# EasyEDA Pro project QV-601-Contril.eprj

# Schematic Schematic1
Board Name: Schematic2; Create Date: 2025-07-12; Page Name: P1; Project Name: QV-601-Contril; Schematic Name: Schematic1; Update Date: 2025-07-23; Company: 嘉立创EDA; Page Size: A4; Version: V1.0
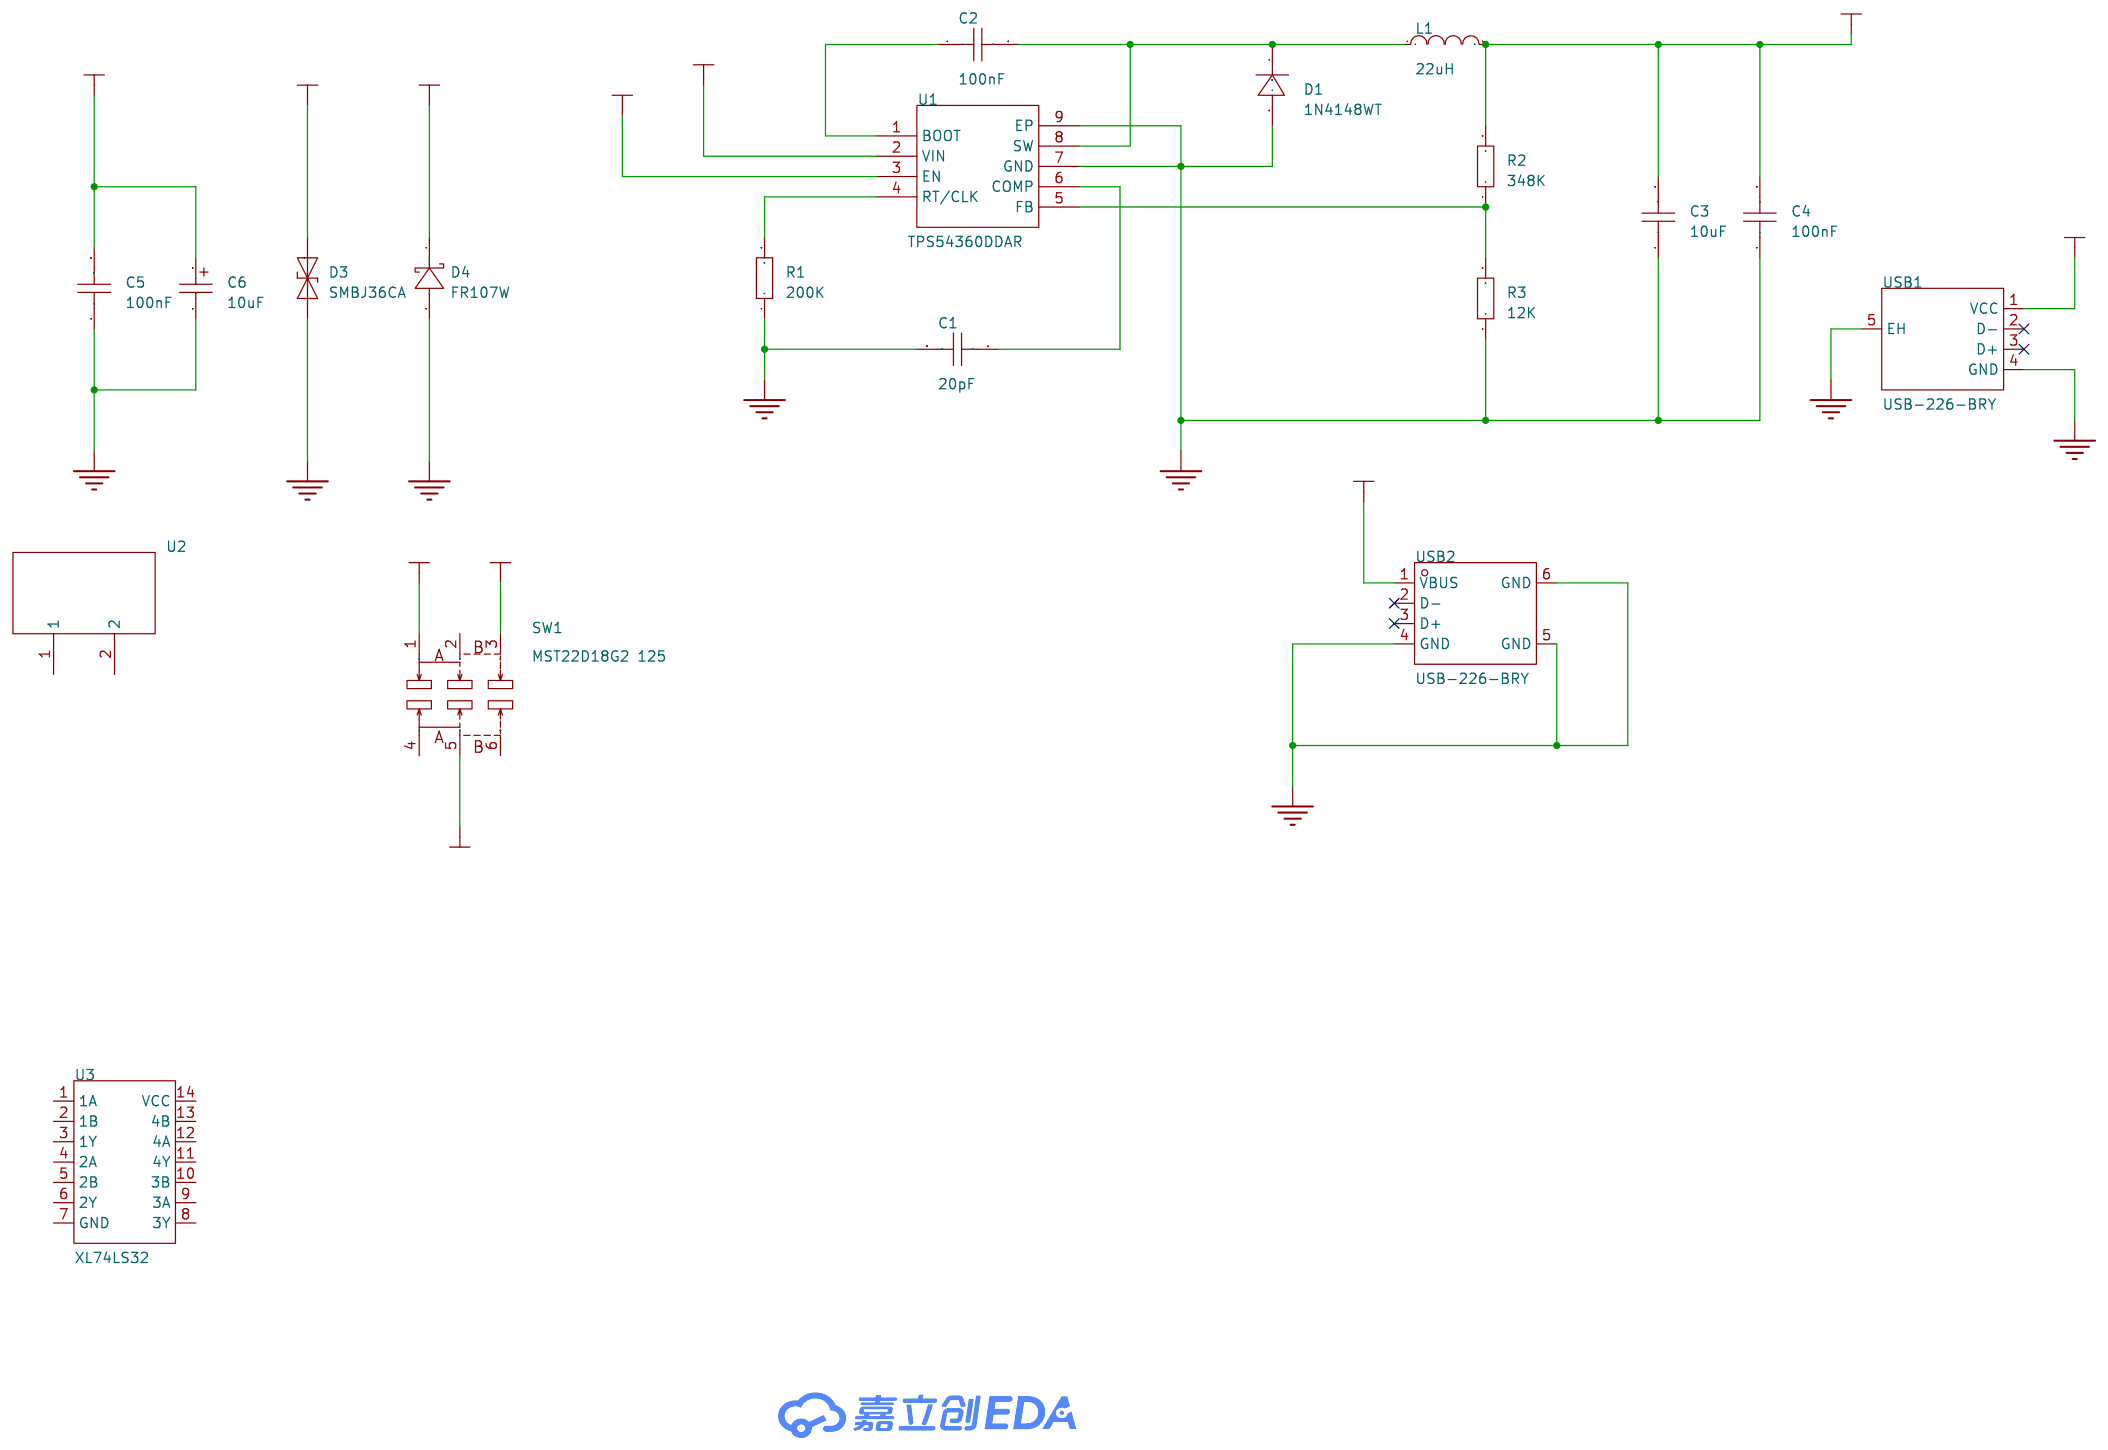
[diagram p0: schematic sheet]

## Parts
C1  20pF  [C0603]
C2  100nF  [C0603]
C3  10uF  [C0603]
C4  100nF  [C0603]
C5  100nF  [C0603]
C6  10uF  [C_Ele_SMD_3x5.4mm]
D1  1N4148WT  [SOD-523_L1.2-W0.8-LS1.6-RD]
D3  SMBJ36CA  [SMB_L4.6-W3.6-LS5.3-BI]
D4  FR107W  [SOD-123FL_L2.7-W1.8-LS3.8-RD]
L1  22uH  [L0603]
R1  200K  [R0603]
R2  348K  [R0603]
R3  12K  [R0603]
SW1  MST22D18G2 125  [SW-SMD_MST22D18G2]
U1  TPS54360DDAR  [SOIC-8_L5.0-W4.0-P1.27-LS6.0-BL-EP2.0]
U2  -  [QS8-S]
U3  XL74LS32  [SOP-14_L8.6-W3.9-P1.27-LS6.0-BL]
USB1  USB-226-BRY  [USB-A-TH_USB-226-BRY]
USB2  USB-226-BRY  [USB-A_TH_USB-256-BRWH150]

## Library data of the parts
C1-C5 = CAP_0603: Supplier Footprint: 0603
C6 = C_Ele_SMD_3x5.4mm: Supplier Footprint: SMD,3x5.4mm
D1 = 1N4148WT_C232841: LCSC Part Name: 电压:75V 电流:300mA; Supplier Part: C232841; Manufacturer: onsemi(安森美); Supplier Footprint: SOD-523F; JLCPCB Part Class: 扩展库; Datasheet: https://atta.szlcsc.com/upload/public/pdf/source/20181222/C232841_42C5BA49E5A441BB8F6B91D0F4CD0D51.pdf; Supplier: LCSC; Diode Configuration: 独立式; Forward Voltage (Vf@If): 1V@10mA; Reverse Voltage (Vr): 75V; Rectified Current: 300mA; Reverse Leakage Current: 5uA@75V; Reverse Recovery Time (trr): 4ns; Operating Temperature: -55℃~+150℃@(Tj)
D3 = SMBJ36CA_C83326: Supplier Part: C83326; Manufacturer: Littelfuse(美国力特); Supplier Footprint: SMB(DO-214AA); JLCPCB Part Class: 扩展库; Datasheet: https://atta.szlcsc.com/upload/public/pdf/source/20190807/C409416_D98C874D944FBE9BE31A2BD6B7A21533.pdf; Supplier: LCSC; polarity: 双向; Reverse Stand-Off Voltage (Vrwm): 36V; Maximum Clamping Voltage: 58.1V; Peak Pulse Current (Ipp): 10.4A; Peak Pulse Power Dissipation (Ppp): 600W; Breakdown Voltage: 40V; Type: TVS
D4 = FR107W_C18199114: Supplier Part: C18199114; Manufacturer: 宏嘉诚; Supplier Footprint: SOD-123FL; JLCPCB Part Class: 扩展库; Datasheet: https://atta.szlcsc.com/upload/public/pdf/source/20250116/CFD3D02D7202F2D6A6FEE7AEEDFF5E78.pdf; Supplier: LCSC; Diode Configuration: 独立式; Voltage - Forward(Vf@If): 1.3V@1.0A; Voltage - DC Reverse(Vr): 1kV; Current - Rectified: 1A; Reverse Leakage Current (Ir): 2uA@1000V; Reverse Recovery Time (trr): 500ns; Operating Temperature: -55℃~+150℃
L1 = L_0603
R1-R3 = Res_0603: Supplier Footprint: 0603
SW1 = MST22D18G2 125: LCSC Part Name: 拨动开关/两档立式 6脚贴片 柄长2.0mm 大六立贴 9.1*3.5mm; Supplier Part: C2906280; Manufacturer: SHOU HAN(首韩); Supplier Footprint: SMD; JLCPCB Part Class: 扩展库; Datasheet: https://atta.szlcsc.com/upload/public/pdf/source/20211019/449AD4EDF23AADA7A5C4E3C063EDBB30.pdf; Supplier: LCSC; Circuit: 双刀双掷; Pin Style: 鸥翼型; Mounting Style: 立贴; Actuator Color: 黑色; Current Rating (DC): 100mA; Voltage Rating (DC): 12V; Mechanical Life: 1万次; Operating Temperature: -25℃~+70℃
U1 = TPS54360DDAR: LCSC Part Name: 60V输入、3.5A输出降压DC-DC转换器; Supplier Part: C44377; Manufacturer: TI(德州仪器); Supplier Footprint: SOIC-8-EP; JLCPCB Part Class: 扩展库; Datasheet: https://www.ti.com/cn/lit/gpn/tps54360; Supplier: LCSC; Function: 降压型; Output Type: 可调; Input Voltage: 4.5V~60V; Output Voltage: 800mV~58.8V; Output Current: 3.5A; Switching Frequency: 2.5MHz; Operating Temperature: -40℃~+150℃@(TJ); Synchronous Rectification: 否; Number of Outputs: 1; Topology: 降压式; Switch tube (built-in/external): 内置
U2 = QS8-S
U3 = XL74LS32: Supplier Part: C521171; Manufacturer: XINLUDA(信路达); Supplier Footprint: SOP-14; JLCPCB Part Class: 扩展库; Datasheet: https://atta.szlcsc.com/upload/public/pdf/source/20250314/78143E60B3C3BA26B82B813CC99E43A0.pdf; Supplier: LCSC
USB1 = USB-226-BRY: LCSC Part Name: Type-A 母 侧插; Supplier Part: C720523; Manufacturer: XUNPU(讯普); Supplier Footprint: 插件; JLCPCB Part Class: 扩展库; Datasheet: https://atta.szlcsc.com/upload/public/pdf/source/20250304/9D0DDAB7BEF0F27DF71E5AD865AFBDD8.pdf; Supplier: LCSC; Connector Type: Type-A; Protocol Standard: USB 2.0; Gender: 母; Mounting Type: 侧插; Number of Contacts: 4P; Number of Ports: 1; Current Rating-Power: 1.5A; Operating Temperature: -20℃~+70℃
USB2 = USB-256-BRWH150: LCSC Part Name: Type-A 母 直插; Supplier Part: C720544; Manufacturer: XUNPU(讯普); Supplier Footprint: 插件; JLCPCB Part Class: 扩展库; Datasheet: https://atta.szlcsc.com/upload/public/pdf/source/20200812/C720544_3A01B35EF472B7FB04986893C594DBBE.pdf; Supplier: LCSC; Connector Type: Type-A; Standard: USB 2.0; Gender: 母; Number of Ports: 1; Number of Contacts: 4P; Mounting Style: 直插; Current Rating - Power (Max): 1.5A; Operating Temperature Range: -20℃~+70℃; Soldering Temperature(Max): 260℃

## Nets
GND: C1.2 C3.1 C4.1 C5.1 C6.2 D1.2(A) D3.1(K) D4.2(A) R1.1 R3.1 U1.7(GND) U1.9(EP) USB1.4(GND) USB1.5(EH) USB2.4(GND) USB2.5(GND) USB2.6(GND)
VCC_5V: U1.3(EN) USB1.1(VCC) USB2.1(VBUS)
VCC_24V: C3.2 C4.2 D3.2(A) D4.1(K) L1.2 R2.2 SW1.1 SW1.5
V+: C5.2 C6.1 SW1.3 U1.2(VIN)
Net-(C1-1): C1.1 U1.6(COMP)
Net-(C2-1): C2.1 U1.1(BOOT)
Net-(C2-2): C2.2 D1.1(C) L1.1 U1.8(SW)
Net-(R1-2): R1.2 U1.4(RT/CLK)
Net-(R2-1): R2.1 R3.2 U1.5(FB)

Not connected (* = marked no-connect by the designer): SW1 2 4 6; U2 1 2; U3 1(1A) 2(1B) 3(1Y) 4(2A) 5(2B) 6(2Y) 7(GND) 8(3Y) 9(3A) 10(3B) 11(4Y) 12(4A) 13(4B) 14(VCC); USB1 2(D-)* 3(D+)*; USB2 2(D-)* 3(D+)*

# Board QV-601-Contril
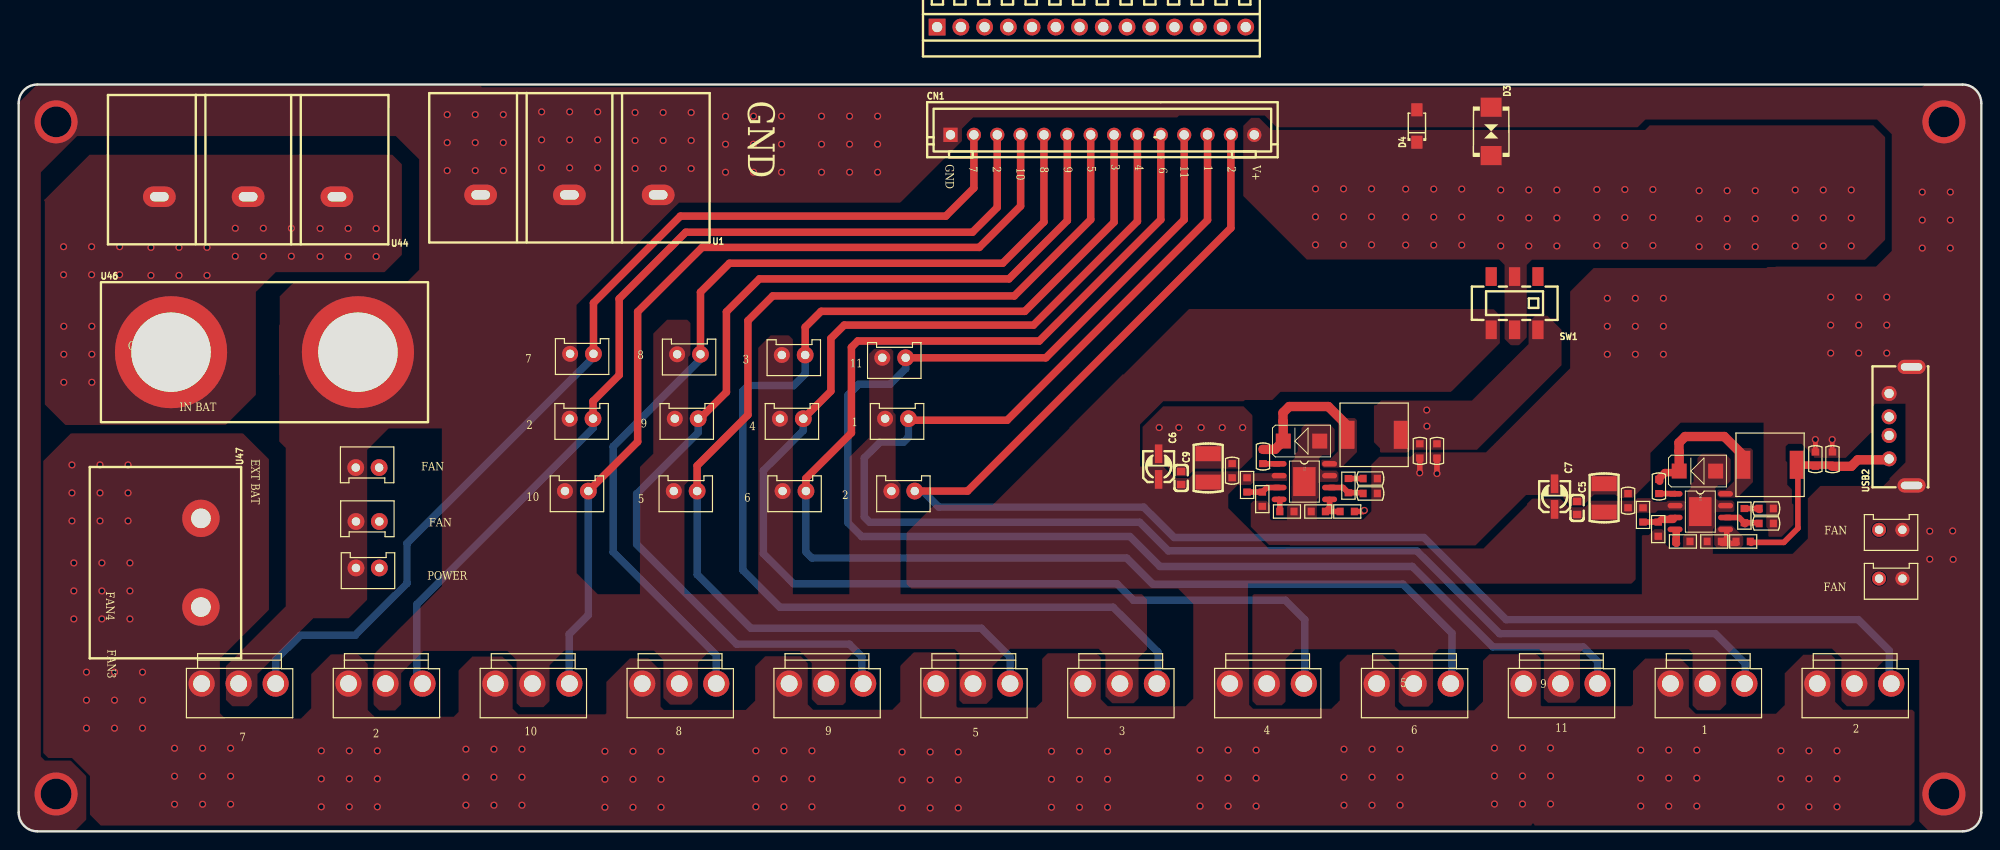
[diagram p1: board, top side]
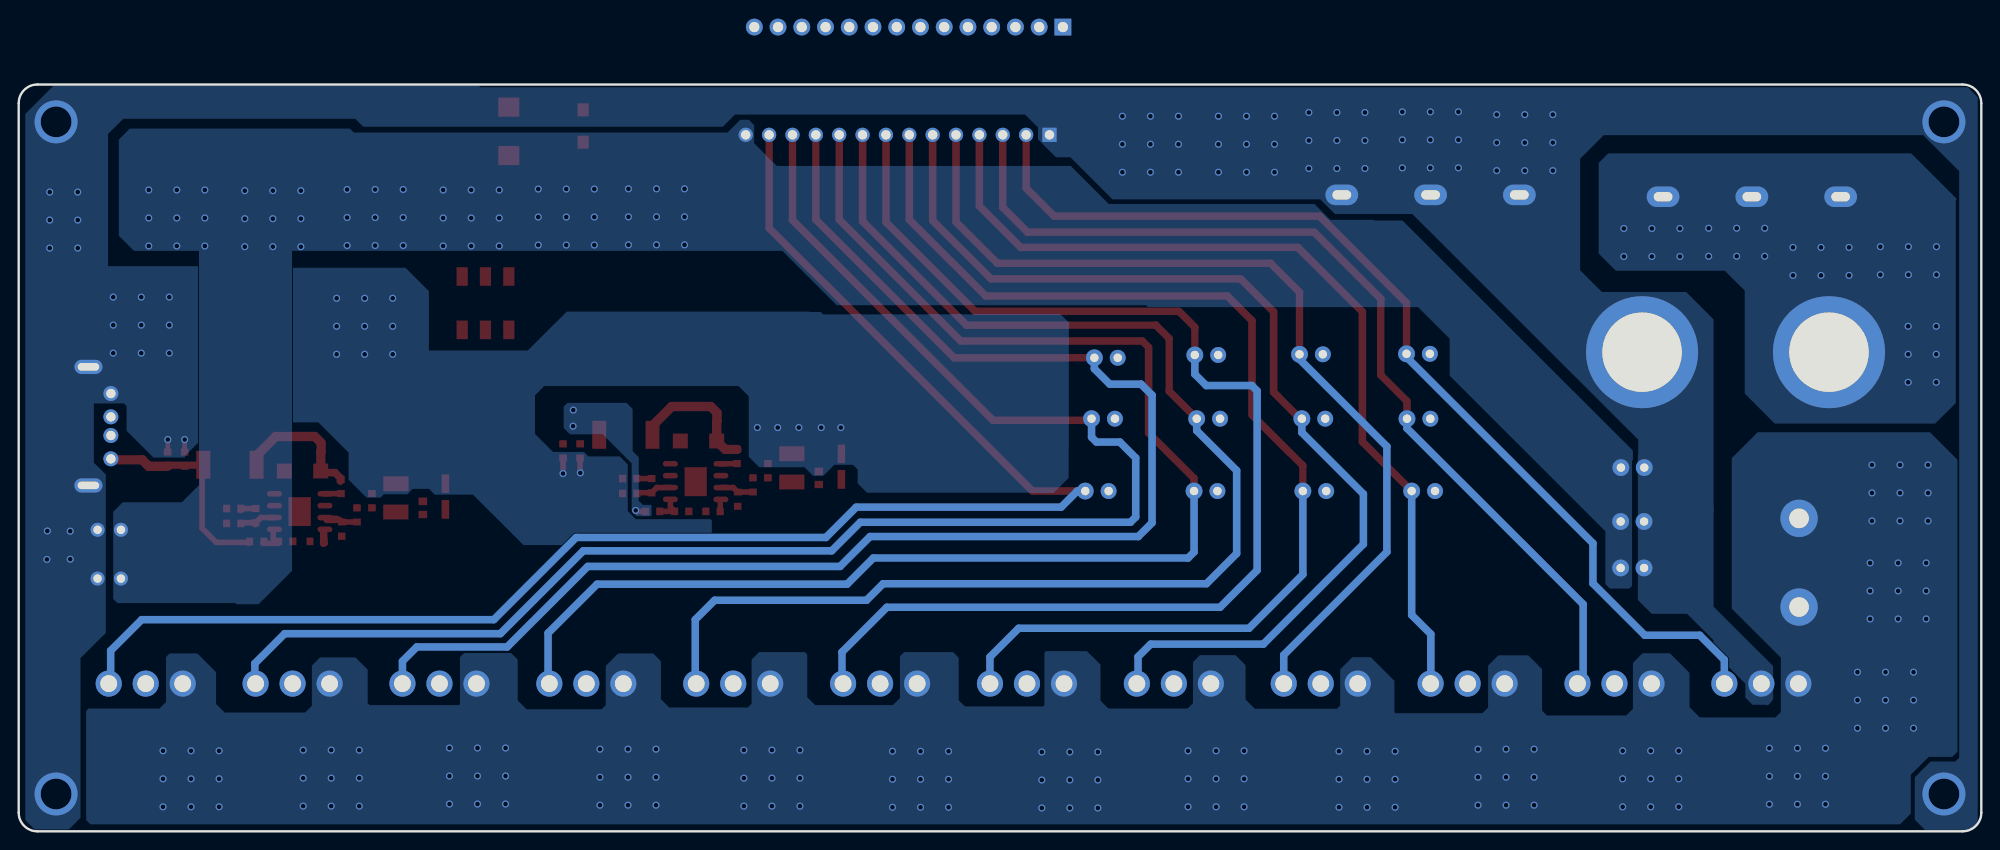
[diagram p2: board, bottom side, seen from below]

Outline 210 x 80 mm; copper layers: Top Layer, Bottom Layer. Coordinates in mm from the lower left corner of the outline.
Outline path: 0,78 0,2 arc(0.59,0.59) 2,0 208,0 arc(209.41,0.59) 210,2 210,78 arc(209.41,79.41) 208,80 2,80 arc(0.59,79.41) 0,78
Stack: Top Layer 0.035mm / Dielectric1 1.51mm FR4 er 4.5 / Bottom Layer 0.035mm

## Design rules (mm)
net J1: Top Side Components
net L4: Top Side Components
net R40: Top Side Components
net R38: Top Side Components
net R37: Top Side Components
net R39: Top Side Components
net R36: Top Side Components
net R35: Top Side Components
net D1: Top Side Components
net C56: Top Side Components
net C52: Top Side Components
net C57: Top Side Components
net C54: Top Side Components
net C53: Top Side Components
net C59: Top Side Components
net C58: Top Side Components
net U41: Top Side Components
net U40: Top Side Components
net J9: Top Side Components
net J8: Top Side Components
net J7: Top Side Components
net J6: Top Side Components
net J5: Top Side Components
net J4: Top Side Components
net J3: Top Side Components
net J15: Top Side Components
net J14: Top Side Components
net J13: Top Side Components
net J12: Top Side Components
net J11: Top Side Components
net J10: Top Side Components
net U9: Top Side Components
net U8: Top Side Components
net U7: Top Side Components
net U6: Top Side Components
net U5: Top Side Components
net U12: Top Side Components
net U11: Top Side Components
net U10: Top Side Components
net U2: Top Side Components
net U3: Top Side Components
net U1: Top Side Components
net J2: Top Side Components
net U4: Top Side Components
template: 用户自定义配置
spacing Clearance (default): track to track 0.254, other pairs 0 to 0.254
track width Width (default): min 0.5, default 1, max 2
differential pair DiffPairsRouting (default): width min 0.381, default 0.381, max 0.381; gap min 0.254, default 0.254
via RoutingVias (default): diameter min 0.61, default 0.762, max 4.6; hole min 0.305, default 0.508, max 3.3

## Placement (name value [footprint] x y rotation side)
C1  20pF  [C0603#2]  149.93 40.75 270 top
C2  100nF  [C0603#2]  151.76 40.75 270 top
C3  10uF  [C1210]  127.27 38.93 90 top
C4  100nF  [C0603#2]  129.84 38.63 90 top
C5  100nF  [C0603]  166.75 34.64 270 top
C6  10uF  [C_Ele_SMD_3x5.4mm]  121.98 39.07 270 top
C7  10uF  [C_Ele_SMD_3x5.4mm]  164.35 35.86 270 top
C8  CAP NP_C0603_100NF  [C0603#2]  133.14 40.15 90 top
C9  100nF  [C0603]  124.38 37.85 270 top
C10  CAP NP_C0603_100NF  [C0603#2]  144.62 37.79 180 top
C11  CAP NP_C0603_100NF  [C0603#2]  144.62 36.19 180 top
C52  CAP NP_C0603_100NF  [C0603#2]  175.51 36.94 90 top
C53  CAP NP_C0603_10UF/10V  [C0603#2]  194.07 39.86 90 top
C54  CAP NP_C0603_10UF/10V  [C0603#2]  192.24 39.86 90 top
C56  CAP NP_C1210_10UF/50V  [C1210]  169.64 35.72 90 top
C57  CAP NP_C0603_100NF  [C0603#2]  172.2 35.42 90 top
C58  CAP NP_C0603_100NF  [C0603#2]  186.99 32.98 180 top
C59  CAP NP_C0603_100NF  [C0603#2]  186.99 34.58 180 top
CN1  ZX-XH2.54-14PZZ  [CONN-TH_14P-P2.50_ZX-XH2.54-14PZZ]  115.96 74.61 0 top
D1  1N4148WT  [SMA]  179.63 38.59 180 top
D2  SS54_SMA_SS34  [SMA]  137.26 41.81 180 top
D3  SMBJ36CA  [SMB_L4.6-W3.6-LS5.3-BI]  157.56 74.98 270 top
D4  FR107W  [SOD-123FL_L2.7-W1.8-LS3.8-RD]  149.61 75.55 90 top
J1  CON2_XH2R54-21_ZX-XH2.54-2PZZ  [XH2R54-21#2]  70.09 36.45 0 top
J2  CON2_XH2R54-21_ZX-XH2.54-2PZZ  [XH2R54-21#2]  92.7 44.2 0 top
J3  CON2_XH2R54-21_ZX-XH2.54-2PZZ  [XH2R54-21]  38.56 38.96 180 top
J4  CON2_XH2R54-21_ZX-XH2.54-2PZZ  [XH2R54-21#3]  199.06 27.08 0 top
J5  CON2_XH2R54-21_ZX-XH2.54-2PZZ  [XH2R54-21#3]  199.06 32.3 0 top
J6  CON2_XH2R54-21_ZX-XH2.54-2PZZ  [XH2R54-21#2]  59 51.15 0 top
J7  CON2_XH2R54-21_ZX-XH2.54-2PZZ  [XH2R54-21#2]  58.95 44.2 0 top
J8  CON2_XH2R54-21_ZX-XH2.54-2PZZ  [XH2R54-21#2]  58.45 36.45 0 top
J9  CON2_XH2R54-21_ZX-XH2.54-2PZZ  [XH2R54-21#2]  70.45 51.1 0 top
J10  CON2_XH2R54-21_ZX-XH2.54-2PZZ  [XH2R54-21#2]  70.2 44.2 0 top
J11  CON2_XH2R54-21_ZX-XH2.54-2PZZ  [XH2R54-21]  36.09 28.21 0 top
J12  CON2_XH2R54-21_ZX-XH2.54-2PZZ  [XH2R54-21#2]  81.65 51.03 0 top
J13  CON2_XH2R54-21_ZX-XH2.54-2PZZ  [XH2R54-21#2]  81.45 44.2 0 top
J14  CON2_XH2R54-21_ZX-XH2.54-2PZZ  [XH2R54-21#2]  93.38 36.45 0 top
J15  CON2_XH2R54-21_ZX-XH2.54-2PZZ  [XH2R54-21]  38.59 33.19 180 top
J16  CON2_XH2R54-21_ZX-XH2.54-2PZZ  [XH2R54-21#2]  81.74 36.45 0 top
J17  CON2_XH2R54-21_ZX-XH2.54-2PZZ  [XH2R54-21#2]  92.4 50.73 0 top
L1  22uH  [L0650]  142.18 42.48 90 top
L4  JLSHC0630_3R3M_L0650_CYA0650-22  [L0650]  184.55 39.27 90 top
R1  200K  [R0603]  131.44 37.11 90 top
R2  348K  [R0603]  133.06 35.58 90 top
R3  12K  [R0603]  142.28 37.03 270 top
R4  R2_R0603_160K  [R0603]  135.7 34.26 180 top
R5  R2_R0603_10K  [R0603]  139.06 34.26 0 top
R6  R2_R0603_230K  [R0603]  142.16 34.26 0 top
R35  R2_R0603_32K  [R0603]  184.52 31.05 0 top
R36  R2_R0603_8K  [R0603]  181.42 31.05 0 top
R37  R2_R0603_51K  [R0603]  173.8 33.9 90 top
R38  R2_R0603_10K  [R0603]  184.65 33.82 270 top
R39  R2_R0603_8K  [R0603]  175.43 32.37 90 top
R40  R2_R0603_160K  [R0603]  178.07 31.05 180 top
SW1  MST22D18G2 125  [SW-SMD_MST22D18G2]  160.06 56.58 180 top
U1  TPS54360DDAR  [CONN-TH_3P-P9.50_DBT50G-9.5-3P]  58.93 68.18 180 top
U2  TPS54360BDDAR_SOIC8E_TPS54360BD  [SOIC8E]  137.57 37.46 270 top
U3  XL74LS32  [VH3R96-3P1]  149.26 15.83 0 top
U4  CON3_VH3R96-3P1_VH3.96-3P ZZ  [VH3R96-3P1]  164.98 15.83 0 top
U5  CON3_VH3R96-3P1_VH3.96-3P ZZ  [VH3R96-3P1]  133.55 15.83 0 top
U6  CON3_VH3R96-3P1_VH3.96-3P ZZ  [VH3R96-3P1]  23.53 15.83 0 top
U7  CON3_VH3R96-3P1_VH3.96-3P ZZ  [VH3R96-3P1]  39.25 15.83 0 top
U8  CON3_VH3R96-3P1_VH3.96-3P ZZ  [VH3R96-3P1]  54.97 15.83 0 top
U9  CON3_VH3R96-3P1_VH3.96-3P ZZ  [VH3R96-3P1]  70.68 15.83 0 top
U10  CON3_VH3R96-3P1_VH3.96-3P ZZ  [VH3R96-3P1]  86.4 15.83 0 top
U11  CON3_VH3R96-3P1_VH3.96-3P ZZ  [VH3R96-3P1]  117.83 15.83 0 top
U12  CON3_VH3R96-3P1_VH3.96-3P ZZ  [VH3R96-3P1]  102.11 15.83 0 top
U13  CON3_VH3R96-3P1_VH3.96-3P ZZ  [VH3R96-3P1]  180.69 15.83 0 top
U14  CON3_VH3R96-3P1_VH3.96-3P ZZ  [VH3R96-3P1]  196.41 15.83 0 top
U40  TPS54360BDDAR_SOIC8E_TPS54360BD  [SOIC8E]  179.93 34.25 270 top
U44  DBT50G-9.5-3P-BK-P OGC  [CONN-TH_3P-P9.50_DBT50G-9.5-3P]  24.55 67.98 180 top
U46  -  [QS8-S]  8.8 43.83 0 top
U47  DBT50G-9.5-2P-BK-P OGC  [CONN-TH_2P-P9.50_DBT50G-9.5-2P]  19.5 28.78 270 top
U48  DB125-2.54-14P-GN-S  [CONN-TH_DB125-2.54-14P-GN-S]  114.78 86.15 0 top
USB2  USB-226-BRY  [USB-A_TH_USB-256-BRWH150]  201.33 43.4 90 top

## Footprints (pads in the part's own frame, mm; a bottom-side part is the same pattern mirrored in y, then rotated)
C0603
  rect 0.8x0.9 smd: 1(-0.7,0) 2(0.7,0)
C0603#2
  rect 0.762x0.813 smd: 1(-0.762,0) 2(0.762,0)
C1210
  rect 1.6x2.7 smd: 1(-1.516,0) 2(1.516,0)
C_Ele_SMD_3x5.4mm
  rect 1.999x0.8 smd: 1(1.374,-0.014) 2(-1.364,-0.014)
CONN-TH_2P-P9.50_DBT50G-9.5-2P
  round 4 hole 2.1: 1(-4.75,0) 2(4.75,0)
CONN-TH_3P-P9.50_DBT50G-9.5-3P
  oval 3.5x2.2 hole 2x1: 1(-9.5,0) 2(0,0) 3(9.5,0)
CONN-TH_14P-P2.50_ZX-XH2.54-14PZZ
  rect 1.524x1.524 hole 1: 1(-16.25,0)
  round 1.524 hole 1: 2(-13.75,0) 3(-11.25,0) 4(-8.75,0) 5(-6.25,0) 6(-3.75,0) 7(-1.25,0) 8(1.25,0) 9(3.75,0) 10(6.25,0) 11(8.75,0) 12(11.25,0) 13(13.75,0) 14(16.25,0)
CONN-TH_DB125-2.54-14P-GN-S
  rect 1.8x1.8 hole 1.1: 1(-16.51,0)
  round 1.8 hole 1.1: 2(-13.97,0) 3(-11.43,0) 4(-8.89,0) 5(-6.35,0) 6(-3.81,0) 7(-1.27,0) 8(1.27,0) 9(3.81,0) 10(6.35,0) 11(8.89,0) 12(11.43,0) 13(13.97,0) 14(16.51,0)
L0650
  rect 3x1.5 smd: 1(0,0) 2(0,-5.7)
QS8-S
  round 12 hole 8.5: 1(7.5,7.5) 2(27.5,7.5)
R0603
  rect 0.762x0.813 smd: 1(-0.762,0) 2(0.762,0)
SMA
  rect 1.6x1.6 smd: 1(-1.95,0) 2(1.95,0)
SMB_L4.6-W3.6-LS5.3-BI
  rect 2.047x2.241 smd: 1(-2.591,0) 2(2.591,0)
SOD-123FL_L2.7-W1.8-LS3.8-RD
  rect 1.4x1.2 smd: 1(-1.735,0) 2(1.735,0)
SOIC8E
  oval 0.6x1.6 smd: 1(-1.905,-2.7) 2(-0.635,-2.7) 3(0.635,-2.7) 4(1.905,-2.7) 5(1.905,2.7) 6(0.635,2.7) 7(-0.635,2.7) 8(-1.905,2.7)
  rect 3.1x2.4 smd: 9(0,0)
SW-SMD_MST22D18G2
  rect 1.2x2 smd: 1(-2.5,2.85) 2(0,2.85) 3(2.5,2.85) 4(-2.5,-2.85) 5(0,-2.85) 6(2.5,-2.85)
USB-A_TH_USB-256-BRWH150
  round 1.6 hole 1: 1(-3.5,1.2) 2(-1,1.2) 3(1,1.2) 4(3.5,1.2)
  oval 1.524x3 hole 0.8x2.3: 5(-6.35,-1.2) 6(6.35,-1.2)
VH3R96-3P1
  round 2.8 hole 1.8: 1(-3.96,0) 2(0,0) 3(3.96,0)
XH2R54-21
  round 1.8 hole 0.9: 1(0,0) 2(2.5,0)
XH2R54-21#2
  round 1.7 hole 0.9: 1(0,0)
  round 1.8 hole 0.9: 2(2.5,0)
XH2R54-21#3
  round 1.5 hole 0.9: 1(0,0) 2(2.5,0)

## Nets
GND: C1.2 C2.2 C3.2 C4.2 C5.1 C6.2 C7.2 C9.1 C10.1 C11.1 C53.2 C54.2 C56.2 C57.2 C58.1 C59.1 CN1.1 D1.1 D2.1 D3.1 D4.2 J1.1 J2.1 J3.2 J4.2 J5.2 J6.1 J7.1 J8.1 J9.1 J10.1 J11.1 J12.1 J13.1 J14.1 J15.2 J16.1 J17.1 R2.1 R4.1 R5.1 R36.1 R39.1 R40.1 U1.1 U1.2 U1.3 U2.7 U2.9 U3.2 U4.2 U5.2 U6.2 U7.2 U8.2 U9.2 U10.2 U11.2 U12.2 U13.2 U14.2 U40.7 U40.9 U46.2 USB2.4 USB2.5 USB2.6
VCC_5V: C53.1 C54.1 L4.2 R35.2 USB2.1
VCC_24V: CN1.14 D3.2 D4.1 J3.1 J4.1 J5.1 J11.2 J15.1 SW1.2 SW1.5
VCC_24V_OUT: C1.1 C2.1 L1.2 R6.2 SW1.1
1: CN1.13 J14.2 U14.3
1.1: CN1.12 J2.2 U13.3
1.2: CN1.4 J8.2 U8.3
1.4: CN1.6 J10.2 U10.3
1.5: CN1.5 J9.2 U9.3
1.6: CN1.7 J1.2 U12.3
2.4: CN1.11 J17.2 U4.3
2.8: CN1.10 J16.2 U3.3
5.2: CN1.8 J12.2 U11.3
5.8: CN1.2 J6.2 U6.3
433: CN1.9 J13.2 U5.3
900: CN1.3 J7.2 U7.3
N7210: C8.1 U2.1
N7211: R1.1 R2.2 U2.3
N7212: R4.2 U2.4
N7213: C10.2 R3.1
N7214: C11.2 R3.2 U2.6
N7215: R5.2 R6.1 U2.5
V+: C3.1 C4.1 C5.2 C6.1 C7.1 C9.2 C56.1 C57.1 R1.2 R37.2 SW1.3 U2.2 U3.1 U4.1 U5.1 U6.1 U7.1 U8.1 U9.1 U10.1 U11.1 U12.1 U13.1 U14.1 U40.2 U47.1 U47.2
N41242: U44.1 U44.2 U44.3 U46.1
N62769: R37.1 R39.2 U40.3
N62809: R40.2 U40.4
N62825: C52.1 U40.1
N62837: C52.2 D1.2 L4.1 U40.8
N62839: C8.2 D2.2 L1.1 U2.8
N62937: C58.2 R38.2 U40.6
N62993: C59.2 R38.1
N63043: R35.1 R36.2 U40.5

Pads without a net: SW1 4 6; U48 1 2 3 4 5 6 7 8 9 10 11 12 13 14; USB2 2 3

## Via types
v1: diameter 0.762, hole 0.508, Top Layer to Bottom Layer, 304 vias
v2: diameter 4.6, hole 3.3, Top Layer to Bottom Layer, 4 vias

## Routing (per net, layer and track width the routed paths; a pad name or vN(x,y) marks a point on that pad's centre or on a via; arc(x,y) is an arc through that point)
GND: length 5.9
  Top Layer w0.5: C54.2 v1(192.24,41.97) ; 194.05,40.63 v1(194.05,41.97)
  Top Layer w0.6: v1(149.91,38.4) 149.93,38.42 C1.2 ; C2.2 v1(151.76,38.33)
  vias: v1(45.85,76.78) v1(45.85,73.78) v1(45.85,70.78) v1(48.85,76.78) v1(48.85,73.78) v1(48.85,70.78) v1(51.85,76.78) v1(51.85,73.78) v1(51.85,70.78) v1(55.95,77.07) v1(55.95,74.07) v1(55.95,71.07) v1(58.95,77.07) v1(58.95,74.07) v1(58.95,71.07) v1(61.95,77.07) v1(61.95,74.07) v1(61.95,71.07) v1(65.95,77) v1(65.95,74) v1(65.95,71) v1(68.95,77) v1(68.95,74) v1(68.95,71) v1(71.95,77) v1(71.95,74) v1(71.95,71) v1(75.63,76.6) v1(75.63,73.6) v1(75.63,70.6) v1(78.63,76.6) v1(78.63,73.6) v1(78.63,70.6) v1(81.63,76.6) v1(81.63,73.6) v1(81.63,70.6) v1(85.9,76.6) v1(85.9,73.6) v1(85.9,70.6) v1(88.9,76.6) v1(88.9,73.6) v1(88.9,70.6) v1(91.9,76.6) v1(91.9,73.6) v1(91.9,70.6) v1(122.03,43.25) v1(124.13,43.25) v1(126.52,43.25) v1(128.79,43.25) v1(130.96,43.25) v1(169.98,57.1) v1(169.98,54.1) v1(169.98,51.1) v1(172.98,57.1) v1(172.98,54.1) v1(172.98,51.1) v1(175.98,57.1) v1(175.98,54.1) v1(175.98,51.1) v1(193.88,57.23) v1(193.88,54.23) v1(193.88,51.23) v1(196.88,57.23) v1(196.88,54.23) v1(196.88,51.23) v1(199.88,57.23) v1(199.88,54.23) v1(199.88,51.23) v1(203.68,68.48) v1(203.68,65.48) v1(203.68,62.48) v1(204.48,32.15) v1(204.48,29.15) v1(206.68,68.48) v1(206.68,65.48) v1(206.68,62.48) v1(206.94,32.18) v1(206.99,29.13) v2(4,76) v2(4,4) v2(206,76) v2(206,4)
VCC_5V: length 22.4
  Top Layer w0.6: 185.36,30.85 185.46,30.95 188.87,30.95 190.38,32.46 190.38,39.06
  Top Layer w0.8: 190.38,39.06 190.53,38.9 ; 190.58,39.23 194.05,39.23
  Top Layer w1: USB2.1 200.03,39.8 196.79,39.8 196.09,39.1 C53.1
VCC_24V:
  vias: v1(138.76,68.83) v1(138.76,65.83) v1(138.76,62.83) v1(141.76,68.83) v1(141.76,65.83) v1(141.76,62.83) v1(144.76,68.83) v1(144.76,65.83) v1(144.76,62.83) v1(148.41,68.8) v1(148.41,65.8) v1(148.41,62.8) v1(151.41,68.8) v1(151.41,65.8) v1(151.41,62.8) v1(154.41,68.8) v1(154.41,65.8) v1(154.41,62.8) v1(158.58,68.7) v1(158.58,65.7) v1(158.58,62.7) v1(161.58,68.7) v1(161.58,65.7) v1(161.58,62.7) v1(164.58,68.7) v1(164.58,65.7) v1(164.58,62.7) v1(168.86,68.75) v1(168.86,65.75) v1(168.86,62.75) v1(171.86,68.75) v1(171.86,65.75) v1(171.86,62.75) v1(174.86,68.75) v1(174.86,65.75) v1(174.86,62.75) v1(179.81,68.63) v1(179.81,65.63) v1(179.81,62.63) v1(182.81,68.63) v1(182.81,65.63) v1(182.81,62.63) v1(185.81,68.63) v1(185.81,65.63) v1(185.81,62.63) v1(190.08,68.7) v1(190.08,65.7) v1(190.08,62.7) v1(193.08,68.7) v1(193.08,65.7) v1(193.08,62.7) v1(196.08,68.7) v1(196.08,65.7) v1(196.08,62.7)
VCC_24V_OUT: length 1.1
  Top Layer w0.6: R6.2 143.87,34.26 v1(143.98,34.38)
  vias: v1(150.66,45.13) v1(150.68,43.4)
1: length 170.5
  Top Layer w0.8: CN1.13 129.71,64.63 101.53,36.45 J14.2
  Bottom Layer w0.8: U14.3 200.16,16.04 200.16,19.35 196.83,22.68 159.16,22.68 150.36,31.48 123.63,31.48 120.38,34.73 98.45,34.73 96.73,36.45 J14.2
1.1: length 167
  Top Layer w0.8: J2.2 95.37,44.03 105.76,44.03 127.21,65.48 CN1.12
  Bottom Layer w0.8: J2.2 95.2,42.23 94.68,41.7 92.18,41.7 90.48,40 90.48,33.68 91.05,33.11 119.95,33.11 123.01,30.05 149.58,30.05 158.46,21.18 181.53,21.18 184.73,17.98 184.73,15.91 U13.3
1.2: length 96.2
  Top Layer w0.8: J8.2 66.23,41.73 66.23,55.65 73.13,62.55 102.78,62.55 107.21,66.98 CN1.4
  Bottom Layer w0.8: J8.2 60.95,23.18 58.9,21.13 58.9,15.85 U8.3
1.4: length 110.7
  Top Layer w0.8: J10.2 72.88,44.2 75.73,47.05 75.73,55.65 79.25,59.18 105.95,59.18 112.21,65.43 CN1.6
  Bottom Layer w0.8: J10.2 72.7,42.73 66.12,36.14 66.12,30.76 76.83,20.05 88.88,20.05 90.23,18.7 90.23,15.95 U10.3
1.5: length 99.6
  Top Layer w0.8: J9.2 72.95,57.76 76.05,60.85 105.28,60.85 109.71,65.28 CN1.5
  Bottom Layer w0.8: U9.3 74.64,18.89 63.6,29.93 63.6,41.23 72.95,50.58 J9.2
1.6: length 119.7
  Top Layer w0.8: CN1.7 114.71,65.53 106.53,57.35 80.68,57.35 78.03,54.7 78.03,44.6 72.59,39.17 J1.2
  Bottom Layer w0.8: U12.3 106.07,18.68 103.01,21.75 78.35,21.75 72.59,27.51 J1.2
2.4: length 156
  Top Layer w0.8: J17.2 109.91,50.73 124.71,65.53 CN1.11
  Bottom Layer w0.8: U4.3 168.94,18.22 167.41,19.75 157.73,19.75 149.11,28.38 122.11,28.38 118.91,31.58 90.2,31.58 88.73,33.05 88.73,46.73 89.9,47.9 93.25,47.9 94.9,49.55 J17.2
2.8: length 150
  Top Layer w0.8: J16.2 84.24,37.81 89.1,42.68 89.1,51.85 89.78,52.53 109.2,52.53 122.21,65.53 CN1.10
  Bottom Layer w0.8: U3.3 153.36,15.96 153.36,21.23 148.11,26.48 121.36,26.48 118.56,29.28 84.88,29.28 84.24,29.92 J16.2
5.2: length 130.2
  Top Layer w0.8: CN1.8 117.21,65.25 107.66,55.7 85.85,55.7 84.15,54 J12.2
  Bottom Layer w0.8: U11.3 121.91,15.94 121.91,19.2 117.11,24 81.45,24 77.49,27.97 77.49,47.19 78.05,47.75 82.93,47.75 84.15,48.98 J12.2
5.8: length 109.8
  Top Layer w0.8: CN1.2 102.21,68.91 99.2,65.9 70.8,65.9 61.5,56.6 J6.2
  Bottom Layer w0.8: J6.2 61.5,50.8 41.55,30.85 41.55,26.55 36,21 30.13,21 27.49,18.37 U6.3
433: length 141.1
  Top Layer w0.8: CN1.9 119.71,65.35 108.58,54.23 88.33,54.23 86.9,52.8 86.9,47.15 J13.2
  Bottom Layer w0.8: J13.2 83.95,42.93 79.68,38.65 79.68,29.75 82.9,26.53 117.51,26.53 119.28,24.75 135.53,24.75 137.61,22.68 137.61,15.93 U5.3
900: length 102.7
  Top Layer w0.8: CN1.3 104.71,66.83 102.05,64.18 71.38,64.18 64.25,57.05 64.25,48.88 61.45,46.08 J7.2
  Bottom Layer w0.8: J7.2 61.45,43.18 42.6,24.33 42.6,16.43 U7.3
N7210: length 1.7
  Top Layer w0.6: C8.1 133.16,39.37 U2.1
N7211: length 3.6
  Top Layer w0.6: R1.1 R2.2 133.55,36.83 U2.3
N7212: length 1.3
  Top Layer w0.6: U2.4 134.94,35.48 R4.2
N7213: length 1.6
  Top Layer w0.6: R3.1 C10.2
N7214: length 3.9
  Top Layer w0.6: U2.6 141.72,36.83 R3.2 143.78,36.27 C11.2
N7215: length 3.1
  Top Layer w0.6: R6.1 R5.2 140.27,34.71 U2.5
V+:
  vias: v1(5.7,39.25) v1(5.7,36.25) v1(5.7,33.25) v1(5.9,28.75) v1(5.9,25.75) v1(5.9,22.75) v1(7.25,17.05) v1(7.25,14.05) v1(7.25,11.05) v1(8.7,39.25) v1(8.7,36.25) v1(8.7,33.25) v1(8.9,28.75) v1(8.9,25.75) v1(8.9,22.75) v1(10.25,17.05) v1(10.25,14.05) v1(10.25,11.05) v1(11.7,39.25) v1(11.7,36.25) v1(11.7,33.25) v1(11.9,28.75) v1(11.9,25.75) v1(11.9,22.75) v1(13.25,17.05) v1(13.25,14.05) v1(13.25,11.05) v1(16.68,8.9) v1(16.68,5.9) v1(16.68,2.9) v1(19.68,8.9) v1(19.68,5.9) v1(19.68,2.9) v1(22.68,8.9) v1(22.68,5.9) v1(22.68,2.9) v1(32.38,8.63) v1(32.38,5.63) v1(32.38,2.63) v1(35.38,8.63) v1(35.38,5.63) v1(35.38,2.63) v1(38.38,8.63) v1(38.38,5.63) v1(38.38,2.63) v1(47.85,8.8) v1(47.85,5.8) v1(47.85,2.8) v1(50.85,8.8) v1(50.85,5.8) v1(50.85,2.8) v1(53.85,8.8) v1(53.85,5.8) v1(53.85,2.8) v1(62.73,8.58) v1(62.73,5.58) v1(62.73,2.58) v1(65.73,8.58) v1(65.73,5.58) v1(65.73,2.58) v1(68.73,8.58) v1(68.73,5.58) v1(68.73,2.58) v1(78.88,8.63) v1(78.88,5.63) v1(78.88,2.63) v1(81.88,8.63) v1(81.88,5.63) v1(81.88,2.63) v1(84.88,8.63) v1(84.88,5.63) v1(84.88,2.63) v1(94.53,8.5) v1(94.53,5.5) v1(94.53,2.5) v1(97.53,8.5) v1(97.53,5.5) v1(97.53,2.5) v1(100.53,8.5) v1(100.53,5.5) v1(100.53,2.5) v1(110.51,8.58) v1(110.51,5.58) v1(110.51,2.58) v1(113.51,8.58) v1(113.51,5.58) v1(113.51,2.58) v1(116.51,8.58) v1(116.51,5.58) v1(116.51,2.58) v1(126.41,8.7) v1(126.41,5.7) v1(126.41,2.7) v1(129.41,8.7) v1(129.41,5.7) v1(129.41,2.7) v1(132.41,8.7) v1(132.41,5.7) v1(132.41,2.7) v1(141.81,8.8) v1(141.81,5.8) v1(141.81,2.8) v1(144.81,8.8) v1(144.81,5.8) v1(144.81,2.8) v1(147.81,8.8) v1(147.81,5.8) v1(147.81,2.8) v1(157.91,8.93) v1(157.91,5.93) v1(157.91,2.93) v1(160.91,8.93) v1(160.91,5.93) v1(160.91,2.93) v1(163.91,8.93) v1(163.91,5.93) v1(163.91,2.93) v1(173.56,8.7) v1(173.56,5.7) v1(173.56,2.7) v1(176.56,8.7) v1(176.56,5.7) v1(176.56,2.7) v1(179.56,8.7) v1(179.56,5.7) v1(179.56,2.7) v1(188.56,8.63) v1(188.56,5.63) v1(188.56,2.63) v1(191.56,8.63) v1(191.56,5.63) v1(191.56,2.63) v1(194.56,8.63) v1(194.56,5.63) v1(194.56,2.63)
N41242:
  vias: v1(4.8,62.63) v1(4.8,59.63) v1(4.83,54.1) v1(4.83,51.1) v1(4.83,48.1) v1(7.8,62.63) v1(7.8,59.63) v1(7.83,54.1) v1(7.83,51.1) v1(7.83,48.1) v1(10.8,62.63) v1(10.8,59.63) v1(14.15,62.55) v1(14.15,59.55) v1(17.15,62.55) v1(17.15,59.55) v1(20.15,62.55) v1(20.15,59.55) v1(23.18,64.6) v1(23.18,61.6) v1(26.18,64.6) v1(26.18,61.6) v1(29.18,64.6) v1(29.18,61.6) v1(32.25,64.58) v1(32.25,61.58) v1(35.25,64.58) v1(35.25,61.58) v1(38.25,64.58) v1(38.25,61.58)
N62769: length 3.6
  Top Layer w0.6: R37.1 R39.2 175.71,33.42 175.99,33.42 ; 177.04,33.42 U40.3
  Top Layer w0.8: 175.99,33.42 177.04,33.42
N62809: length 1.3
  Top Layer w0.8: 177.39,30.85 177.36,30.88 177.36,32.15
N62825: length 1.7
  Top Layer w0.6: C52.1 177.21,36.18 U40.1
N62837: length 14.7
  Top Layer w0.8: 175.58,37.51 175.58,37.86 176.15,38.43 177.62,38.43
  Top Layer w1: D1.2 177.68,40.66 177.65,40.69 177.65,41.63 178.31,42.29 182.5,42.29 184.6,40.19 184.6,39.25
N62839: length 14.6
  Top Layer w1: 142.23,42.47 142.23,43.4 140.13,45.5 135.94,45.5 135.28,44.84 135.28,43.9 135.31,43.88 D2.2 134.42,40.92 C8.2
N62937: length 3.9
  Top Layer w0.6: C58.2 186.15,33.06 R38.2 184.09,33.62 U40.6 ; 184.73,32.86 184.7,32.88 184.65,32.88
N62993: length 1.7
  Top Layer w0.6: R38.1 C59.2 ; 186.22,34.38 186.3,34.38
N63043: length 3.1
  Top Layer w0.6: 183.84,30.85 182.26,30.85 182.76,31.35 182.76,32.15

## Copper pours and planes (outline as drawn; the poured copper is in the pictures)
GND on Top Layer: 144.95,34.87 144.95,38.2 147.43,38.2 147.43,36.08 146.21,34.87
GND on Top Layer: 165.28,35.68 166.04,34.92 167.43,34.92 169.38,36.88 169.38,37.73 168.51,38.6 165.36,38.6 165.16,38.4 165.28,38.28
GND on Top Layer: outline of 273 points within -0.05,-0.08 210,80
GND on Top Layer: 136.23,35.29 135.7,34.76 135.7,32.33 136.03,32 138.81,32 138.91,32.1 138.91,37.05 139.06,37.2 136.46,37.2 136.21,36.95 136.23,36.93
GND on Top Layer: 131.83,35.13 132.12,35.41 133.5,35.41 133.88,35.03 133.88,33.48 134.03,33.33 136.01,33.33 136.26,33.08 136.26,30.88 136.06,30.68 133.78,30.68 131.83,32.63
GND on Top Layer: 120.23,39.66 120.66,39.23 120.66,39.2 122.63,39.2 122.68,39.25 123.91,38.03 125.06,38.03 125.88,38.85 130.76,38.85 132.01,40.1 132.01,44.58 131.06,45.53 122.46,45.53 120.26,43.33 120.26,39.69
GND on Top Layer: 41.03,21.98 40.53,21.48 40.53,20.28 42.05,21.8 42.2,21.8 41.73,22.28 41.45,22.28 41.15,21.98
GND on Top Layer: 187.32,31.66 187.32,34.99 189.8,34.99 189.8,32.87 188.58,31.66
GND on Top Layer: 179.63,39.99 179.63,39.29 179.22,38.89 179.22,37.49 178.92,37.19 178.92,36.8 178.58,36.45 178.58,32.49 178.82,32.24 181.15,32.24 181.45,32.54 181.45,34.07 181.6,34.22 183.45,34.22 183.57,34.34 183.57,35.22 183.35,35.44 181.83,35.44 181.53,35.74 181.53,36.78 181.82,37.07 182.7,37.07 183.17,37.54 183.17,39.87 182.62,40.42 182.62,40.44 180.07,40.44
GND on Top Layer: 137.26,43.2 137.26,42.51 136.86,42.1 136.86,40.7 136.56,40.41 136.56,40.01 136.21,39.66 136.21,35.7 136.46,35.45 138.78,35.45 139.08,35.75 139.08,37.28 139.23,37.43 141.08,37.43 141.21,37.55 141.21,38.43 140.98,38.65 139.47,38.65 139.17,38.95 139.17,39.99 139.46,40.28 140.33,40.28 140.81,40.75 140.81,43.08 140.26,43.63 140.26,43.65 137.71,43.65
GND on Bottom Layer: 33.7,43.08 35.25,41.53 35.55,41.53 36.7,40.38 36.75,40.38 36.75,24.78 35.28,23.3 31.48,23.3 25.25,17.08 25.25,14.33 24.48,13.55 22.85,13.55 22.28,14.13 22.28,17.7 28.65,24.08 28.65,34.9 29.23,35.48 29.23,38.6
GND on Bottom Layer: 149.51,40.64 152.82,40.64 154.76,42.58 154.76,46.7 153.83,47.63 153.83,47.7 132.98,47.7 131.88,46.6 131.88,40.13 130.76,39 125.91,39 124.98,38.08 123.91,38.08 122.72,39.26 120.67,39.26 120.33,39.6 99.23,39.6 97.63,41.2 97.63,54.5 98.5,55.38 123.93,55.38 124.19,55.64 125.37,55.64 125.41,55.68 151.36,55.68 155.53,51.5 166.11,51.5 166.11,57.87 168.62,60.38 187.95,60.38 188.11,60.54 200.51,60.54 202.93,58.12 202.93,46.34 202.43,45.84 198.68,45.84 198.68,45.77 198.46,45.54 198.46,42.91 195.58,40.04 192.18,40.04 192.18,40.24 190.88,41.54 188.78,41.54 187.71,42.61 187.71,43.94 187.11,43.94 186.98,43.81 177.93,43.81 174.7,40.58 174.7,37.67 172.79,35.75 171.29,35.75 170.93,36.11 168.41,36.11 167.84,36.68 166.09,36.68 165.48,36.06 161.38,36.06 155.98,30.66 136.13,30.66 135.78,31.01 135.83,31.06 135.83,33.29 135.98,33.44 143.96,33.44 144.83,34.31 144.83,39.31 145.68,40.16 149.03,40.16
GND on Bottom Layer: 200.68,38.22 201.96,39.5 201.96,46.11 201.32,46.74 201.32,59.54 200.43,60.43 200.43,74.7 198.81,76.33 173.98,76.33 173.13,75.48 134.66,75.48 133.36,76.78 102.3,76.78 100.93,75.4 100.93,74.13 99.01,72.21 97.46,72.21 92.96,67.7 70.73,67.7 69.15,66.13 60.88,66.13 28.65,33.9 28.65,54.85 31.58,57.78 40.6,57.78 42.93,60.1 42.93,72.05 40.4,74.58 6.28,74.58 6.25,74.6 2.37,70.72 2.37,7.88 2.78,7.48 5.43,7.48 7.12,5.78 7.12,1.25 6.03,0.15 1.05,0.15 0.39,0.82 0.39,78.64 1.45,79.7 160.61,79.7 160.78,79.88 206.26,79.88 209.29,76.85 209.29,1.2 208.29,0.2 204.63,0.2 203.38,1.45 203.38,18.45 203.43,18.5 200.68,21.26
GND on Bottom Layer: 97.65,41.58 97.65,37.85 99.23,36.28 119.23,36.28 120.23,37.28 120.23,38.75 120.78,39.3 120.78,40.35 119.56,41.58
GND on Bottom Layer: 22.3,17.65 28.65,24 28.65,19.23 22.88,13.45 22.45,13.88 22.45,13.98 22.3,14.13 22.3,17.55 22.2,17.65
GND on Bottom Layer: 36.7,42.44 36.7,40.1 36.63,40.03 35.2,40.03 35.2,42.05 35.15,42.1 35.49,42.44
VCC_24V on Top Layer: 145.03,42.48 145.03,40.9 145.31,40.63 146.23,40.63 146.26,40.65 147.16,40.65 147.16,41.92 146.6,42.48
VCC_24V on Top Layer: 131.88,76.43 131.03,75.58 131.03,68.05 137.83,61.25 158.41,61.25 158.98,60.68 158.98,52.75 159.66,52.08 160.53,52.08 161.36,52.9 161.36,60.68 161.91,61.23 197.56,61.23 199.71,63.38 199.71,74.35 198.43,75.63 174.52,75.63 174.03,75.14 134.02,75.14 132.73,76.43
VCC_24V on Bottom Layer: 186.81,24.45 199.43,24.45 199.88,24.9 199.88,34.23 198.86,35.25 192.53,35.25 190.71,37.08 190.71,67.83 190.78,67.9 180.91,67.9 180.76,68.05 180.76,27.9 184.33,24.33 186.68,24.33
VCC_24V on Bottom Layer: 61.91,65.43 64.93,65.43 65,65.5 69.65,65.5 71.35,67.2 93.35,67.2 97.43,71.28 128.88,71.28 131.31,73.7 131.31,75.65 131.88,76.23 132.78,76.23 134.16,74.85 174.13,74.85 174.61,75.33 174.66,75.28 198.11,75.28 199.28,74.1 199.28,63.8 197.66,62.18 128.28,62.18 122.46,56.35 89.35,56.35 89.15,56.15 60.26,56.15 56.89,52.78 56.89,48.81 40.23,32.15 40.23,26.49 39.75,26 37.66,26 37.37,26.29 37.37,39.69 37.28,39.78 37.28,40.79 61.91,65.42
VCC_24V_OUT on Top Layer: 145.66,41.03 145.66,40.58 148.58,40.58 148.88,40.88 156.03,40.88 165.08,49.93 165.08,53.73 163.58,55.23 162.26,55.23 161.56,54.53 161.56,52.2 155.51,46.15 145.78,46.15 145.28,45.65 145.01,45.65 145.01,41.68
VCC_24V_OUT on Bottom Layer: 142.28,34.97 142.28,33.85 142.38,33.75 143.9,33.75 144.41,34.26 144.41,39.42 147.51,42.53 151.01,42.53 151.68,43.2 151.68,45.5 151.28,45.9 144.96,45.9 144.31,45.25 144.31,40.73 143.66,40.08 143.66,35.41 143.22,34.97
V+ on Top Layer: outline of 175 points within 2.62,0.62 202.86,55.95
V+ on Top Layer: 131.44,38.37 135.46,38.37 135.73,38.1 135.73,37.6 135.66,37.53 132.03,37.53 131.82,37.31 131.65,37.31 131.39,37.57 131.39,38.33
V+ on Bottom Layer: outline of 107 points within 2.55,0.75 202.78,42.75
N41242 on Top Layer: 2.8,45.73 5,43.53 22.15,43.53 25.38,46.75 25.38,57.78 27.5,59.9 39.15,59.9 41,61.75 41,71.45 39.98,72.48 7.58,72.48 2.68,67.58 2.8,67.45
N41242 on Bottom Layer: 2.74,45.88 4.94,43.68 22.09,43.68 25.31,46.9 25.31,57.93 27.44,60.05 39.09,60.05 40.94,61.9 40.94,71.6 39.91,72.63 7.51,72.63 2.61,67.73 2.74,67.6
N62837 on Top Layer: 182.03,35.85 183.86,35.85 185.46,37.45 185.46,40.78 185.28,40.96 183.91,40.96 183.63,40.68 183.63,37.45 182.67,36.49 181.86,36.49 181.86,36.03
N62839 on Top Layer: 139.67,39.06 141.5,39.06 143.1,40.66 143.1,43.99 142.92,44.17 141.55,44.17 141.27,43.89 141.27,40.66 140.3,39.7 139.49,39.7 139.49,39.24
N63043 on Top Layer: 181.98,32.75 183.33,32.75 184.52,31.56 184.52,30.67 184.19,30.34 181.75,30.34 181.42,30.67 181.42,32.19

Small or netless copper shapes (teardrops, artwork), in the pictures only: 2 on Top Layer

## Text on the board
Top Silkscreen Layer: Chaarger | IN BAT | 7 | 2 | FAN | POWER | 10 | 8 | 9 | 3 | 5 | 4 | 6 | 11 | FAN4 | FAN3 | EXT BAT | GND | 1 | V+
